# Altium project 28Pins_Project_1[1.PrjPcb (part 2 of 3)
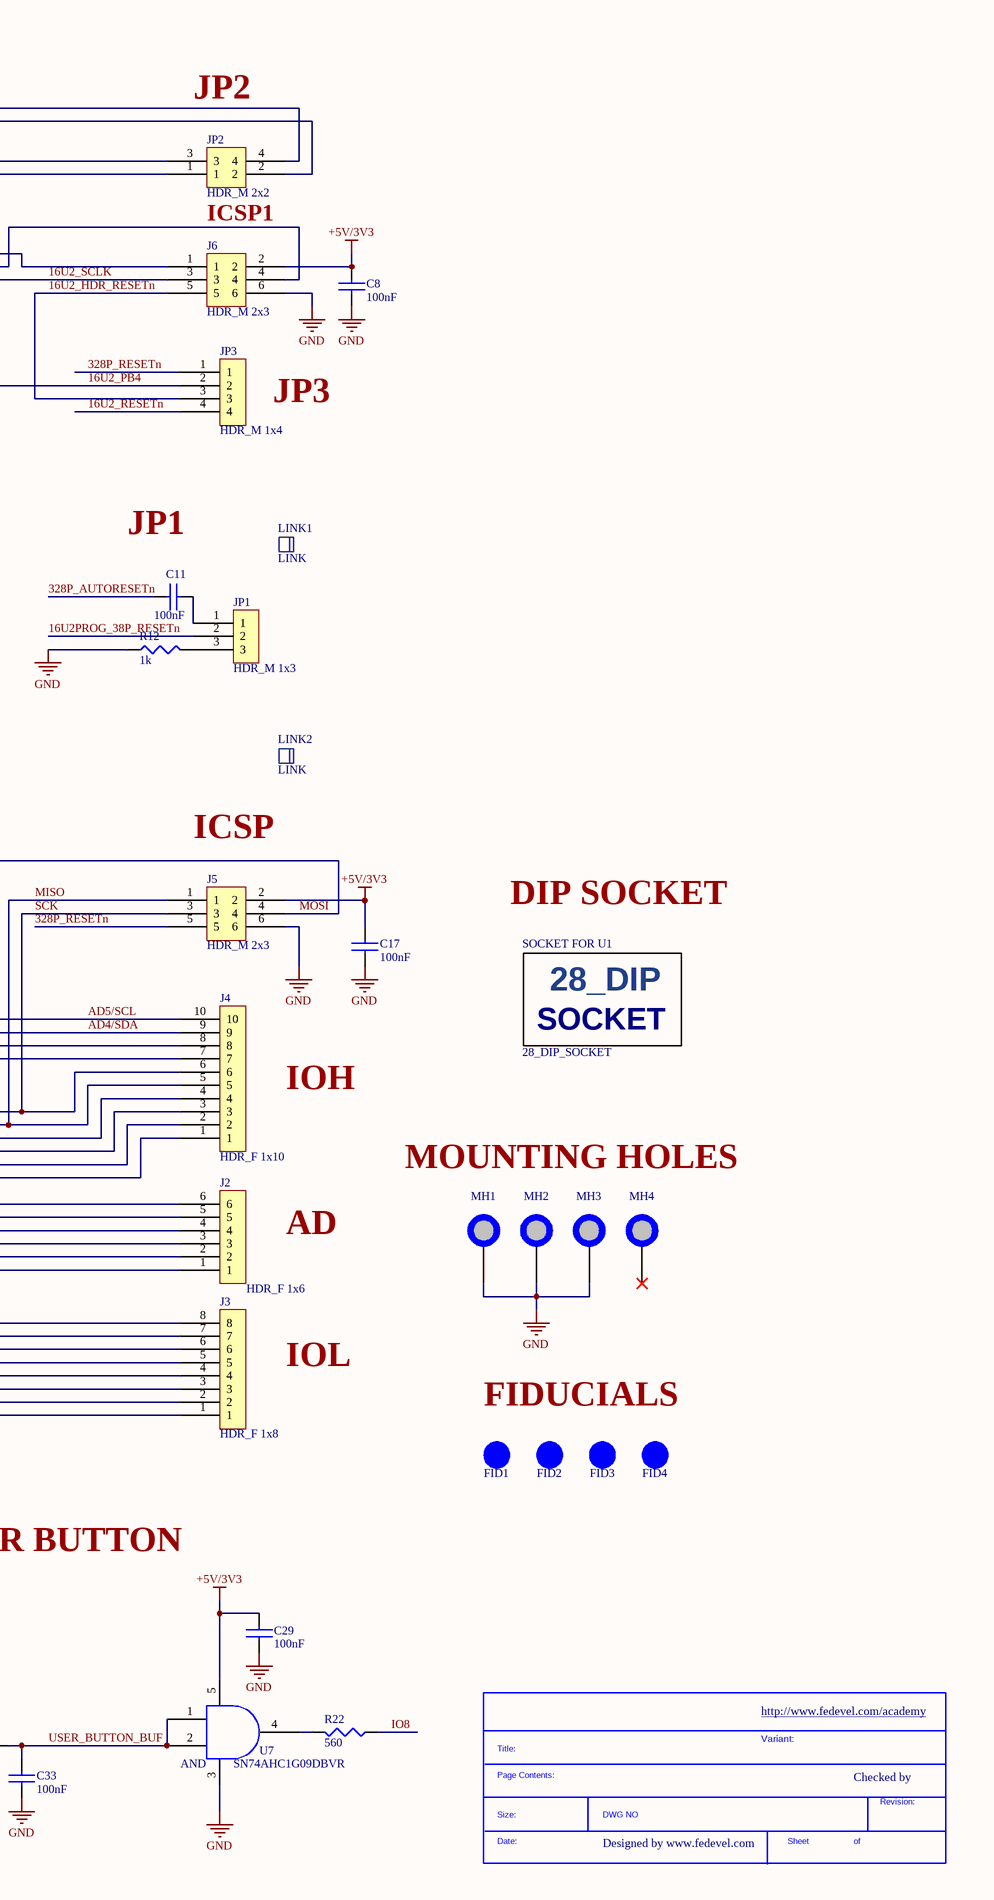
[diagram p3: [03] - 28PINS SCHEMATIC.SchDoc, right]

## Sheet [03] - 28PINS SCHEMATIC.SchDoc: 28 Pins (continued)
### Library data of the parts
C1 C2 = EEE-1AA101WR: Cap Aluminum 100uF 10V 20% (5 X 5.4mm) SMD 50mA 1000 hr 85°C T/R; Manufacturer: Panasonic; Life (Hours): 1000Hour; Supplier 1: Future Electronics; Manufacturer Part Number: EEE-1AA101WR; RoHS: Yes; Category: Aluminum Electrolytic Capacitors; Stock 1: 550; Pricing 1: 1=0,31500, 50=0,15000, 100=0,13300, 250=0,11300, 500=0,10000 (USD); Mount: Surface Mount,PCB; Case/Package: Radial; Contact Plating: Tin; Min Operating Temperature: -40°C; Max Operating Temperature: 85°C; Capacitance: 100uF; Tolerance: 20%; Ripple Current: 50mA; Voltage Rating: 10V; Packaging: Tape and Reel; Package Quantity: 1; Voltage Rating (DC): 10V; Termination: SMD/SMT; Ripple Current (AC): 50mA; Diameter: 5mm; Length: 5.5mm; Height: 5.4mm; Height - Seated (Max): 0.213inch; Radiation Hardening: No; Lead Free: Lead Free; REACH SVHC: Unknown; ComponentLink1URL: https://datasheet.ciiva.com/26945/getdatasheetpartid-169213-26945071.pdf?src-supplier=Verical; ComponentLink1Description: https://datasheet.ciiva.com/26945/getdatasheetpartid-169213-26945071.pdf?src-supplier=Verical; ComponentLink2URL: https://datasheet.ciiva.com/2983/aba0000ce2-2983906.pdf?src-supplier=Avnet; ComponentLink2Description: https://datasheet.ciiva.com/2983/aba0000ce2-2983906.pdf?src-supplier=Avnet; ComponentLink3URL: https://datasheet.ciiva.com/24027/aba0000ce2-40801-24027541.pdf?src-supplier=Mouser; ComponentLink3Description: https://datasheet.ciiva.com/24027/aba0000ce2-40801-24027541.pdf?src-supplier=Mouser; ComponentLink4URL: https://datasheet.ciiva.com/30075/11aba0000ce2-30075303.pdf?src-supplier=Onlinecomponents.com; ComponentLink4Description: https://datasheet.ciiva.com/30075/11aba0000ce2-30075303.pdf?src-supplier=Onlinecomponents.com; ComponentLink5URL: https://datasheet.ciiva.com/16427/aba0000ce2-16427544.pdf?src-supplier=Future+Electronics; ComponentLink5Description: https://datasheet.ciiva.com/16427/aba0000ce2-16427544.pdf?src-supplier=Future+Electronics; ComponentLink6URL: https://datasheet.ciiva.com/14598/70255710-14598233.pdf?src-supplier=Allied+Electronics; ComponentLink6Description: https://datasheet.ciiva.com/14598/70255710-14598233.pdf?src-supplier=Allied+Electronics; ComponentLink7URL: https://datasheet.ciiva.com/14605/70255710-14605689.pdf?src-supplier=Allied+Electronics; ComponentLink7Description: https://datasheet.ciiva.com/14605/70255710-14605689.pdf?src-supplier=Allied+Electronics; ComponentLink8URL: https://datasheet.ciiva.com/11673/aba0000ce2-11673882.pdf?src-supplier=Avnet; ComponentLink8Description: https://datasheet.ciiva.com/11673/aba0000ce2-11673882.pdf?src-supplier=Avnet; Supplier Part Number 1: EEE-1AA101WR-CUTT
C3 C12 C13 C19 C21 C22 C34 = C2012X5R1C106M125AC: CAP CER 10UF 16V X5R 0805; Manufacturer: TDK; Dielectric Material: Ceramic; Tolerance: 20%; Supplier 1: Farnell; Manufacturer Part Number: C2012X5R1C106M125AC; RoHS: Yes; Category: Ceramic Capacitors; Pricing 1: 5=0,27200, 50=0,09480, 250=0,08030, 500=0,07090, 1000=0,06220, 2000=0,04880, 10000=0,04830, 20000=0,04180 (GBP); Mount: Surface Mount; Case/Package: 0805; Number of Pins: 2; Weight: 0.000194oz; Case Code (Metric): 2012; Case Code (Imperial): 0805; Min Operating Temperature: -55°C; Max Operating Temperature: 85°C; Capacitance: 10uF; Voltage Rating: 16V; Packaging: Tape and Reel; Package Quantity: 1; Voltage Rating (DC): 16V; Dielectric: X5R; Termination: SMD/SMT; Composition: Ceramic; Length: 2mm; Height: 1.25mm; Width: 0.049inch; Thickness: 0.057inch; Depth: 1.25mm; REACH SVHC: No SVHC; Lead Free: Lead Free; ComponentLink1URL: https://datasheet.ciiva.com/6289/tdkmlcccaprange-6289238.pdf?src-supplier=Digi-Key; ComponentLink1Description: https://datasheet.ciiva.com/6289/tdkmlcccaprange-6289238.pdf?src-supplier=Digi-Key; ComponentLink2URL: https://datasheet.ciiva.com/22725/1913358-22725558.pdf?src-supplier=Element14; ComponentLink2Description: https://datasheet.ciiva.com/22725/1913358-22725558.pdf?src-supplier=Element14; ComponentLink3URL: https://datasheet.ciiva.com/6252/tdkmlcccaprange-6252105.pdf?src-supplier=Digi-Key; ComponentLink3Description: https://datasheet.ciiva.com/6252/tdkmlcccaprange-6252105.pdf?src-supplier=Digi-Key; ComponentLink4URL: https://datasheet.ciiva.com/6252/tdkmlcccaprange-6252108.pdf?src-supplier=Digi-Key; ComponentLink4Description: https://datasheet.ciiva.com/6252/tdkmlcccaprange-6252108.pdf?src-supplier=Digi-Key; ComponentLink5URL: https://datasheet.ciiva.com/23803/1796654-23803022.pdf?src-supplier=Newark; ComponentLink5Description: https://datasheet.ciiva.com/23803/1796654-23803022.pdf?src-supplier=Newark; Supplier Part Number 1: 2525134
C4-C6 C8 C11 C14-C17 C20 C23 C24 C26 C28-C33 = C2012X7R1H104K085AA: C Series 0805 0.1 uF 50 V ±10 % Tolerance X7R SMT Multilayer Ceramic Capacitor; Manufacturer: TDK; Voltage Rating: 50V; Tolerance: 10%; Supplier 1: Digi-Key; Manufacturer Part Number: C2012X7R1H104K085AA; Category: Ceramic Capacitors; Stock 1: 286254; Pricing 1: 1=0,17000, 10=0,11900, 100=0,05610, 500=0,03936, 1000=0,03258 (USD); Mount: Surface Mount; Case/Package: 0805; Number of Pins: 2; Weight: 0.000194oz; Case Code (Metric): 2012; Case Code (Imperial): 0805; Dielectric Material: Ceramic; Min Operating Temperature: -55°C; Max Operating Temperature: 125°C; Package Quantity: 1; Capacitance: 100nF; Packaging: Tape and Reel; Voltage Rating (DC): 50V; Dielectric: X7R; Termination: SMD/SMT; Composition: Ceramic; Voltage: 50V; Length: 2mm; Height: 0.85mm; Width: 0.049inch; Thickness: 0.037inch; Depth: 1.25mm; Radiation Hardening: No; REACH SVHC: No SVHC; Lead Free: Lead Free; ComponentLink1URL: https://datasheet.ciiva.com/11788/0900766b80c1bb00-11788128.pdf?src-supplier=RSComponents; ComponentLink1Description: https://datasheet.ciiva.com/11788/0900766b80c1bb00-11788128.pdf?src-supplier=RSComponents; ComponentLink2URL: https://datasheet.ciiva.com/24191/e412-c-24191447.pdf?src-supplier=Future+Electronics; ComponentLink2Description: https://datasheet.ciiva.com/24191/e412-c-24191447.pdf?src-supplier=Future+Electronics; ComponentLink3URL: https://datasheet.ciiva.com/6250/tdkmlcccaprange-6250821.pdf?src-supplier=Digi-Key; ComponentLink3Description: https://datasheet.ciiva.com/6250/tdkmlcccaprange-6250821.pdf?src-supplier=Digi-Key; ComponentLink4URL: https://datasheet.ciiva.com/6250/tdkmlcccaprange-6250824.pdf?src-supplier=Digi-Key; ComponentLink4Description: https://datasheet.ciiva.com/6250/tdkmlcccaprange-6250824.pdf?src-supplier=Digi-Key; ComponentLink5URL: https://datasheet.ciiva.com/23803/1796654-23803035.pdf?src-supplier=Newark; ComponentLink5Description: https://datasheet.ciiva.com/23803/1796654-23803035.pdf?src-supplier=Newark; ComponentLink6URL: https://datasheet.ciiva.com/28602/1571323-28602204.pdf?src-supplier=Element14; ComponentLink6Description: https://datasheet.ciiva.com/28602/1571323-28602204.pdf?src-supplier=Element14; ComponentLink7URL: http://datasheet.octopart.com/C2012X7R1H104K085AA-TDK-datasheet-10978788.pdf?src-supplier=Element14; ComponentLink7Description: http://datasheet.octopart.com/C2012X7R1H104K085AA-TDK-datasheet-10978788.pdf?src-supplier=Element14; ComponentLink8URL: http://datasheet.octopart.com/C2012X7R1H104K085AA-TDK-datasheet-41194876.pdf?src-supplier=Element14; ComponentLink8Description: http://datasheet.octopart.com/C2012X7R1H104K085AA-TDK-datasheet-41194876.pdf?src-supplier=Element14; ComponentLink9URL: http://datasheet.octopart.com/C2012X7R1H104K085AA-TDK-datasheet-13444418.pdf?src-supplier=Newark; ComponentLink9Description: http://datasheet.octopart.com/C2012X7R1H104K085AA-TDK-datasheet-13444418.pdf?src-supplier=Newark; ComponentLink10URL: http://datasheet.octopart.com/C2012X7R1H104K085AA-TDK-datasheet-13376850.pdf?src-supplier=Element14; ComponentLink10Description: http://datasheet.octopart.com/C2012X7R1H104K085AA-TDK-datasheet-13376850.pdf?src-supplier=Element14; ComponentLink11URL: http://datasheet.octopart.com/C2012X7R1H104K085AA-TDK-datasheet-41169347.pdf?src-supplier=Element14; ComponentLink11Description: http://datasheet.octopart.com/C2012X7R1H104K085AA-TDK-datasheet-41169347.pdf?src-supplier=Element14; ComponentLink12URL: http://datasheet.octopart.com/C2012X7R1H104K085AA-TDK-datasheet-82475248.pdf?src-supplier=Newark; ComponentLink12Description: http://datasheet.octopart.com/C2012X7R1H104K085AA-TDK-datasheet-82475248.pdf?src-supplier=Newark; ComponentLink13URL: http://datasheet.octopart.com/C2012X7R1H104K085AA-TDK-datasheet-128946.pdf?src-supplier=Future+Electronics; ComponentLink13Description: http://datasheet.octopart.com/C2012X7R1H104K085AA-TDK-datasheet-128946.pdf?src-supplier=Future+Electronics; ComponentLink14URL: http://datasheet.octopart.com/C2012X7R1H104K085AA-TDK-datasheet-8324322.pdf?src-supplier=Future+Electronics; ComponentLink14Description: http://datasheet.octopart.com/C2012X7R1H104K085AA-TDK-datasheet-8324322.pdf?src-supplier=Future+Electronics; ComponentLink15URL: http://datasheet.octopart.com/C2012X7R1H104K085AA-TDK-datasheet-8359770.pdf?src-supplier=Future+Electronics; ComponentLink15Description: http://datasheet.octopart.com/C2012X7R1H104K085AA-TDK-datasheet-8359770.pdf?src-supplier=Future+Electronics; ComponentLink16URL: http://datasheet.octopart.com/C2012X7R1H104K085AA-TDK-datasheet-8852320.pdf?src-supplier=Future+Electronics; ComponentLink16Description: http://datasheet.octopart.com/C2012X7R1H104K085AA-TDK-datasheet-8852320.pdf?src-supplier=Future+Electronics; ComponentLink17URL: http://datasheet.octopart.com/C2012X7R1H104K085AA-TDK-datasheet-12509848.pdf?src-supplier=Future+Electronics; ComponentLink17Description: http://datasheet.octopart.com/C2012X7R1H104K085AA-TDK-datasheet-12509848.pdf?src-supplier=Future+Electronics; ComponentLink18URL: http://datasheet.octopart.com/C2012X7R1H104K085AA-TDK-datasheet-23766614.pdf?src-supplier=Newark; ComponentLink18Description: http://datasheet.octopart.com/C2012X7R1H104K085AA-TDK-datasheet-23766614.pdf?src-supplier=Newark; ComponentLink19URL: http://datasheet.octopart.com/C2012X7R1H104K085AA-TDK-datasheet-11730548.pdf?src-supplier=Electro+Sonic; ComponentLink19Description: http://datasheet.octopart.com/C2012X7R1H104K085AA-TDK-datasheet-11730548.pdf?src-supplier=Electro+Sonic; ComponentLink20URL: http://datasheet.octopart.com/C-Series-Ceramic-Chip-Capacitors-TDK-datasheet-family-84.pdf; ComponentLink20Description: http://datasheet.octopart.com/C-Series-Ceramic-Chip-Capacitors-TDK-datasheet-family-84.pdf; Supplier Part Number 1: 445-7534-1-ND
C7 = C2012X5R1E105K125AA: CAP CER 1UF 25V X5R 0805; Manufacturer: TDK; Dielectric Material: Ceramic; Tolerance: 10%; Supplier 1: Avnet; Manufacturer Part Number: C2012X5R1E105K125AA; RoHS: Yes; Category: Ceramic Capacitors; Stock 1: 2000; Pricing 1: 2000=0,02803, 4000=0,02689, 8000=0,02588, 12000=0,02490, 20000=0,02443 (USD); Mount: Surface Mount; Case/Package: 0805; Number of Pins: 2; Weight: 0.000194oz; Case Code (Metric): 2012; Case Code (Imperial): 0805; Min Operating Temperature: -55°C; Max Operating Temperature: 85°C; Capacitance: 1uF; Voltage Rating: 25V; Packaging: Tape and Reel; Voltage Rating (DC): 25V; Dielectric: X5R; Termination: SMD/SMT; Package Quantity: 2000; Composition: Ceramic; Voltage: 25V; Length: 2mm; Height: 1.25mm; Depth: 1.25mm; Width: 0.049inch; Thickness: 0.057inch; Radiation Hardening: No; Lead Free: Lead Free; REACH SVHC: No SVHC; ComponentLink1URL: https://datasheet.ciiva.com/11787/0900766b80c1bb00-11787608.pdf?src-supplier=RSComponents; ComponentLink1Description: https://datasheet.ciiva.com/11787/0900766b80c1bb00-11787608.pdf?src-supplier=RSComponents; ComponentLink2URL: https://datasheet.ciiva.com/16449/e412-c-16449595.pdf?src-supplier=Future+Electronics; ComponentLink2Description: https://datasheet.ciiva.com/16449/e412-c-16449595.pdf?src-supplier=Future+Electronics; ComponentLink3URL: https://datasheet.ciiva.com/28602/1744655-28602171.pdf?src-supplier=Element14; ComponentLink3Description: https://datasheet.ciiva.com/28602/1744655-28602171.pdf?src-supplier=Element14; ComponentLink4URL: https://datasheet.ciiva.com/15192/getdatasheetpartid-726707-15192140.pdf?src-supplier=Verical; ComponentLink4Description: https://datasheet.ciiva.com/15192/getdatasheetpartid-726707-15192140.pdf?src-supplier=Verical; Supplier Part Number 1: C2012X5R1E105K125AA
C9 C10 C25 C27 = C0805C180J5GACTU: CAP CER 18PF 50V C0G/NP0 0805; Manufacturer: KEMET; Dielectric Material: Ceramic; Tolerance: 5%; Dielectric: C0G; Temperature Coefficient: 30ppm/°C; Supplier 1: Digi-Key; Manufacturer Part Number: C0805C180J5GACTU; RoHS: Yes; Category: Ceramic Capacitors; Stock 1: 88952; Pricing 1: 1=0,14000, 10=0,10000, 100=0,04680, 500=0,03282, 1000=0,02716 (USD); Mount: Surface Mount; Case/Package: 0805; Contact Plating: Tin,Matte; Min Operating Temperature: -55°C; Max Operating Temperature: 125°C; Capacitance: 18pF; Packaging: Tape and Reel; Voltage: 50V; Termination: SMD/SMT; Voltage Rating (DC): 50V; Length: 2mm; Height: 0.78mm; Depth: 1.25mm; Radiation Hardening: No; Lead Free: Lead Free; ComponentLink1URL: https://datasheet.ciiva.com/22746/1769375-22746770.pdf?src-supplier=Element14; ComponentLink1Description: https://datasheet.ciiva.com/22746/1769375-22746770.pdf?src-supplier=Element14; ComponentLink2URL: https://datasheet.ciiva.com/26923/getdatasheetpartid-759702-26923980.pdf?src-supplier=Verical; ComponentLink2Description: https://datasheet.ciiva.com/26923/getdatasheetpartid-759702-26923980.pdf?src-supplier=Verical; ComponentLink3URL: https://datasheet.ciiva.com/26847/getdatasheetpartid-385668-26847862.pdf?src-supplier=Verical; ComponentLink3Description: https://datasheet.ciiva.com/26847/getdatasheetpartid-385668-26847862.pdf?src-supplier=Verical; Supplier Part Number 1: 399-1112-1-ND
D1 = LGL29K-G2J1-24-Z: LED Uni-Color Green 572nm 2-Pin Chip 0603(1608Metric) T/R; Manufacturer: Osram Opto; Lens Color: White; Forward Current: 20mA; Forward Voltage: 2.2V; Luminous Intensity: 5.6mcd; Viewing Angle: 160°; Lens Style: Flat,Diffused,Colorless,Rectangular; Test Current: 2mA; Dominant Wavelength: 570nm; Luminous Flux: 0.012lm; Number of LEDs: 1; Lens Transparency: Diffused; Reverse Voltage: 12V; Lens Size: 0.8mm; Supplier 1: Mouser; Manufacturer Part Number: LGL29K-G2J1-24-Z; RoHS: Yes; Category: Uncategorized; Stock 1: 225780; Pricing 1: 1=0,50000, 10=0,36000, 100=0,17000, 1000=0,13300, 5000=0,10500, 10000=0,09800 (USD); Mount: Surface Mount; Case/Package: 0603; Number of Pins: 2; Color: Green; Case Code (Metric): 1608; Case Code (Imperial): 0603; Min Operating Temperature: -40°C; Max Operating Temperature: 100°C; Illumination Color: Green; Packaging: Tape and Reel; Package Quantity: 5000; Number of Elements: 1; Length: 1.3mm; Height: 0.65mm; Width: 0.8mm; Depth: 0.8mm; Radiation Hardening: No; ComponentLink1URL: https://datasheet.ciiva.com/4689/g-l29k-39844-4689584.pdf?src-supplier=Mouser; ComponentLink1Description: https://datasheet.ciiva.com/4689/g-l29k-39844-4689584.pdf?src-supplier=Mouser; ComponentLink2URL: https://datasheet.ciiva.com/15198/getdatasheetpartid-571127-15198411.pdf?src-supplier=Verical; ComponentLink2Description: https://datasheet.ciiva.com/15198/getdatasheetpartid-571127-15198411.pdf?src-supplier=Verical; ComponentLink3URL: https://datasheet.ciiva.com/2112/00077107-0-2112886.pdf?src-supplier=Digi-Key; ComponentLink3Description: https://datasheet.ciiva.com/2112/00077107-0-2112886.pdf?src-supplier=Digi-Key; ComponentLink4URL: https://datasheet.ciiva.com/2112/00077107-0-2112887.pdf?src-supplier=Digi-Key; ComponentLink4Description: https://datasheet.ciiva.com/2112/00077107-0-2112887.pdf?src-supplier=Digi-Key; ComponentLink5URL: https://datasheet.ciiva.com/2112/00077107-0-2112888.pdf?src-supplier=Digi-Key; ComponentLink5Description: https://datasheet.ciiva.com/2112/00077107-0-2112888.pdf?src-supplier=Digi-Key; Supplier Part Number 1: 720-LGL29KG2J124Z
D2-D4 = LOL29K-H2K1-24-Z: LED ORANGE DIFFUSED 0603 SMD; Manufacturer: Osram Opto; Forward Current: 20mA; Forward Voltage: 1.8V; Luminous Intensity: 6.3mcd; Viewing Angle: 160°; Lens Style: Diffused,Colorless,Rectangular; Test Current: 2mA; Dominant Wavelength: 606nm; Luminous Flux: 0.025lm; Number of LEDs: 1; Supplier 1: Newark; Manufacturer Part Number: LOL29K-H2K1-24-Z; RoHS: Yes; Category: Uncategorized; Mount: Surface Mount; Case/Package: 0603; Number of Pins: 2; Color: Orange; Case Code (Metric): 1608; Case Code (Imperial): 0603; Min Operating Temperature: -40°C; Max Operating Temperature: 100°C; Illumination Color: Orange; Packaging: Tape and Reel; Package Quantity: 5000; Length: 1.7mm; Height: 0.65mm; Width: 0.8mm; ComponentLink1URL: https://datasheet.ciiva.com/2112/00077105-0-2112904.pdf?src-supplier=Digi-Key; ComponentLink1Description: https://datasheet.ciiva.com/2112/00077105-0-2112904.pdf?src-supplier=Digi-Key; ComponentLink2URL: https://datasheet.ciiva.com/2112/00077105-0-2112905.pdf?src-supplier=Digi-Key; ComponentLink2Description: https://datasheet.ciiva.com/2112/00077105-0-2112905.pdf?src-supplier=Digi-Key; ComponentLink3URL: https://datasheet.ciiva.com/2112/00077105-0-2112906.pdf?src-supplier=Digi-Key; ComponentLink3Description: https://datasheet.ciiva.com/2112/00077105-0-2112906.pdf?src-supplier=Digi-Key; ComponentLink4URL: https://datasheet.ciiva.com/15198/getdatasheetpartid-693885-15198412.pdf?src-supplier=Verical; ComponentLink4Description: https://datasheet.ciiva.com/15198/getdatasheetpartid-693885-15198412.pdf?src-supplier=Verical; Supplier Part Number 1: 32AC1122
D5 D6 = BAT54HT1G: DIODE SCHOTTKY 30V 200MA SOD323; Manufacturer: ON Semiconductor / Fairchild; Forward Voltage: 800mV; Recovery Time: 5ns; Peak Non-Repetitive Surge Current: 600mA; Element Configuration: Single; Peak Reverse Current: 2uA; Power Dissipation: 200mW; Polarity: Standard; Capacitance: 10pF; Supplier 1: Future Electronics; Manufacturer Part Number: BAT54HT1G; RoHS: Yes; Category: Rectifier Diodes; Stock 1: 6016316; Pricing 1: 1=0,18600, 250=0,06030, 500=0,05230, 750=0,04810, 1500=0,04180 (USD); Mount: Surface Mount; Number of Pins: 2; Contact Plating: Tin,Matte; Min Operating Temperature: -55°C; Max Operating Temperature: 150°C; Packaging: Tape and Reel; Package Quantity: 3000; Forward Current: 200mA; Average Rectified Current: 200mA; Reverse Recovery Time: 5ns; Max Repetitive Reverse Voltage (Vrrm): 30V; Max Forward Surge Current (Ifsm): 600mA; Max Reverse Voltage (DC): 30V; Max Surge Current: 600mA; Voltage Rating (DC): 30V; Current Rating: 200mA; Output Current: 200mA; Reverse Voltage: 30V; Max Reverse Leakage Current: 2uA; Length: 1.8mm; Height: 1mm; Width: 1.35mm; Radiation Hardening: No; Lead Free: Lead Free; REACH SVHC: No SVHC; ComponentLink1URL: https://datasheet.ciiva.com/4714/bat54ht1-d-72881-4714706.pdf?src-supplier=Mouser; ComponentLink1Description: https://datasheet.ciiva.com/4714/bat54ht1-d-72881-4714706.pdf?src-supplier=Mouser; ComponentLink2URL: https://datasheet.ciiva.com/30479/0900766b811a63a9-30479442.pdf?src-supplier=RSComponents; ComponentLink2Description: https://datasheet.ciiva.com/30479/0900766b811a63a9-30479442.pdf?src-supplier=RSComponents; ComponentLink3URL: https://datasheet.ciiva.com/34301/806549-34301562.pdf?src-supplier=Jameco; ComponentLink3Description: https://datasheet.ciiva.com/34301/806549-34301562.pdf?src-supplier=Jameco; ComponentLink4URL: https://datasheet.ciiva.com/1240/1747983-1240762.pdf?src-supplier=Newark; ComponentLink4Description: https://datasheet.ciiva.com/1240/1747983-1240762.pdf?src-supplier=Newark; ComponentLink5URL: https://datasheet.ciiva.com/4452/bat54ht1g-104602-4452889.pdf?src-supplier=Mouser; ComponentLink5Description: https://datasheet.ciiva.com/4452/bat54ht1g-104602-4452889.pdf?src-supplier=Mouser; ComponentLink6URL: https://datasheet.ciiva.com/910/bat54ht1g-910497.pdf?src-supplier=Digi-Key; ComponentLink6Description: https://datasheet.ciiva.com/910/bat54ht1g-910497.pdf?src-supplier=Digi-Key; ComponentLink7URL: https://datasheet.ciiva.com/1180/bat54ht1-d-1180252.pdf?src-supplier=Element14; ComponentLink7Description: https://datasheet.ciiva.com/1180/bat54ht1-d-1180252.pdf?src-supplier=Element14; ComponentLink8URL: https://datasheet.ciiva.com/1180/bat54ht1-d-1180251.pdf?src-supplier=Element14; ComponentLink8Description: https://datasheet.ciiva.com/1180/bat54ht1-d-1180251.pdf?src-supplier=Element14; ComponentLink9URL: https://datasheet.ciiva.com/46429/1727620-46429206.pdf?src-supplier=Element14; ComponentLink9Description: https://datasheet.ciiva.com/46429/1727620-46429206.pdf?src-supplier=Element14; ComponentLink10URL: https://datasheet.ciiva.com/8294/bat54ht1-d-8294645.pdf?src-supplier=Avnet; ComponentLink10Description: https://datasheet.ciiva.com/8294/bat54ht1-d-8294645.pdf?src-supplier=Avnet; ComponentLink11URL: https://datasheet.ciiva.com/915/bat54ht1-d-915445.pdf?src-supplier=Digi-Key; ComponentLink11Description: https://datasheet.ciiva.com/915/bat54ht1-d-915445.pdf?src-supplier=Digi-Key; ComponentLink12URL: https://datasheet.ciiva.com/915/bat54ht1-d-915444.pdf?src-supplier=Digi-Key; ComponentLink12Description: https://datasheet.ciiva.com/915/bat54ht1-d-915444.pdf?src-supplier=Digi-Key; ComponentLink13URL: https://datasheet.ciiva.com/915/bat54ht1-d-915443.pdf?src-supplier=Digi-Key; ComponentLink13Description: https://datasheet.ciiva.com/915/bat54ht1-d-915443.pdf?src-supplier=Digi-Key; ComponentLink14URL: https://datasheet.ciiva.com/910/bat54ht1g-910499.pdf?src-supplier=Digi-Key; ComponentLink14Description: https://datasheet.ciiva.com/910/bat54ht1g-910499.pdf?src-supplier=Digi-Key; ComponentLink15URL: https://datasheet.ciiva.com/910/bat54ht1g-910498.pdf?src-supplier=Digi-Key; ComponentLink15Description: https://datasheet.ciiva.com/910/bat54ht1g-910498.pdf?src-supplier=Digi-Key; ComponentLink16URL: https://datasheet.ciiva.com/8303/bat54ht1g-8303645.pdf?src-supplier=Avnet; ComponentLink16Description: https://datasheet.ciiva.com/8303/bat54ht1g-8303645.pdf?src-supplier=Avnet; ComponentLink17URL: https://datasheet.ciiva.com/17020/bat54ht1g-17020445.pdf?src-supplier=Future+Electronics; ComponentLink17Description: https://datasheet.ciiva.com/17020/bat54ht1g-17020445.pdf?src-supplier=Future+Electronics; ComponentLink18URL: https://datasheet.ciiva.com/48686/001262925-da-01-en-diode-schottky-30v-bat54ht1g-sod-323-fsc-48686266.pdf?src-supplier=Conrad; ComponentLink18Description: https://datasheet.ciiva.com/48686/001262925-da-01-en-diode-schottky-30v-bat54ht1g-sod-323-fsc-48686266.pdf?src-supplier=Conrad; Supplier Part Number 1: BAT54HT1G-CUTT
FB1-FB3 = MPZ2012S601AT000: Ferrite Beads Multi-Layer Power 600Ohm 25% 100MHz 2A 100mOhm DCR 0805 T/R; Manufacturer: TDK; Impedance: 600R; DC Resistance (DCR): 100mR; Supplier 1: Digi-Key; Manufacturer Part Number: MPZ2012S601AT000; RoHS: Yes; Category: Inductors; Stock 1: 128173; Pricing 1: 1=0,11000, 10=0,09100, 25=0,07040, 50=0,05840, 100=0,05030, 250=0,04028, 500=0,03624, 1000=0,03020 (USD); Mount: Surface Mount; Case/Package: 0805; Case Code (Metric): 2012; Case Code (Imperial): 0805; Packaging: Tape and Reel; Package Quantity: 1; Current Rating: 2A; Max DC Current: 2A; Length: 0.079inch; Height: 0.041inch; Width: 0.049inch; REACH SVHC: No SVHC; Lead Free: Lead Free; ComponentLink1URL: https://datasheet.ciiva.com/46634/beads-commercial-power-mpz-en-46634377.pdf?src-supplier=Digi-Key; ComponentLink1Description: https://datasheet.ciiva.com/46634/beads-commercial-power-mpz-en-46634377.pdf?src-supplier=Digi-Key; ComponentLink2URL: https://datasheet.ciiva.com/46634/beads-commercial-power-mpz-en-46634606.pdf?src-supplier=Digi-Key; ComponentLink2Description: https://datasheet.ciiva.com/46634/beads-commercial-power-mpz-en-46634606.pdf?src-supplier=Digi-Key; ComponentLink3URL: https://datasheet.ciiva.com/46634/beads-commercial-power-mpz-en-46634335.pdf?src-supplier=Digi-Key; ComponentLink3Description: https://datasheet.ciiva.com/46634/beads-commercial-power-mpz-en-46634335.pdf?src-supplier=Digi-Key; Supplier Part Number 1: 445-2206-1-ND
FID1-FID4 = FID_1mm: Fiducial 40mil Diameter, 120mil mask
J1 J3 = M20-7820842: 2.54mm (0.1") Pitch SIL Vertical PC Tail Socket Assembly, selective gold + tin, 8 contacts; Manufacturer: Harwin; Max Current Rating: 3A; Contact Resistance: 20mR; Number of Positions: 8; Connector Type: Receptacle; Gender: Female; Supplier 1: Digi-Key; Manufacturer Part Number: M20-7820842; Category: Headers and Wire Housings; Stock 1: 3264; Pricing 1: 1=1,10000, 10=0,97200, 100=0,83820, 500=0,68580, 1000=0,60960, 5000=0,53340, 10000=0,50673 (USD); Mount: Through Hole; Case/Package: SIL; Weight: 0.025397oz; Contact Plating: Tin; Color: Black; Contact Material: Bronze; Housing Color: Black; Housing Material: Polyamide; Min Operating Temperature: -40°C; Max Operating Temperature: 105°C; Number of Rows: 1; Contact Gender: Female; Package Quantity: 29; Packaging: Rail/Tube; Termination: Solder; Number of Contacts: 8; Orientation: Straight; Length: 20.72mm; Pitch: 2.54mm; Depth: 2.5mm; Radiation Hardening: No; ComponentLink1URL: https://datasheet.ciiva.com/16732/m20-782-16732663.pdf?src-supplier=Avnet+Europe; ComponentLink1Description: https://datasheet.ciiva.com/16732/m20-782-16732663.pdf?src-supplier=Avnet+Europe; ComponentLink2URL: https://datasheet.ciiva.com/9480/m20-782-9480074.pdf?src-supplier=Avnet; ComponentLink2Description: https://datasheet.ciiva.com/9480/m20-782-9480074.pdf?src-supplier=Avnet; ComponentLink3URL: http://datasheet.octopart.com/M20-7820842-Harwin-datasheet-99119574.pdf; ComponentLink3Description: http://datasheet.octopart.com/M20-7820842-Harwin-datasheet-99119574.pdf; Supplier Part Number 1: 952-1823-ND
J2 = M20-7820646: 2.54mm (0.1") Pitch SIL Vertical PC Tail Socket Assembly, tin, 6 contacts; Manufacturer: Harwin; Max Current Rating: 3A; Contact Resistance: 20mR; Connector Type: Receptacle; Number of Positions: 6; Gender: Female; Supplier 1: Digi-Key; Manufacturer Part Number: M20-7820646; Category: Headers and Wire Housings; Stock 1: 1623; Pricing 1: 1=0,96000, 10=0,84200, 100=0,72600, 500=0,59400, 1000=0,52800, 5000=0,46200, 10000=0,43890 (USD); Mount: Through Hole; Case/Package: SIL; Color: Black; Contact Plating: Tin; Contact Material: Bronze; Housing Color: Black; Housing Material: Nylon; Min Operating Temperature: -40°C; Max Operating Temperature: 105°C; Packaging: Rail/Tube; Number of Rows: 1; Contact Gender: Female; Package Quantity: 38; Termination: Solder; Number of Contacts: 6; Orientation: Straight; Length: 15.64mm; Pitch: 2.54mm; Depth: 2.5mm; Radiation Hardening: No; ComponentLink1URL: http://components.arrow.com/part/dataview/0323_00725884?src-supplier=Arrow+Europe; ComponentLink1Description: http://components.arrow.com/part/dataview/0323_00725884?src-supplier=Arrow+Europe; ComponentLink2URL: http://www.harwin.com/include/downloads/pdfs/2010PAGE120.PDF?src-supplier=Avnet; ComponentLink2Description: http://www.harwin.com/include/downloads/pdfs/2010PAGE120.PDF?src-supplier=Avnet; ComponentLink3URL: https://cdn.harwin.com/pdfs/M20-782.pdf?src-supplier=Digi-Key; ComponentLink3Description: https://cdn.harwin.com/pdfs/M20-782.pdf?src-supplier=Digi-Key; ComponentLink4URL: https://cdn.harwin.com/pdfs/Harwin_PC_Connectors_M20.pdf?src-supplier=Avnet+Europe; ComponentLink4Description: https://cdn.harwin.com/pdfs/Harwin_PC_Connectors_M20.pdf?src-supplier=Avnet+Europe; ComponentLink5URL: https://cdn.harwin.com/pdfs/Harwin_PC_Connectors_M20.pdf?src-supplier=Mouser; ComponentLink5Description: https://cdn.harwin.com/pdfs/Harwin_PC_Connectors_M20.pdf?src-supplier=Mouser; ComponentLink6URL: https://cdn.harwin.com/pdfs/Harwin_PC_Connectors_M20.pdf?src-supplier=RSComponents; ComponentLink6Description: https://cdn.harwin.com/pdfs/Harwin_PC_Connectors_M20.pdf?src-supplier=RSComponents; ComponentLink7URL: https://cdn.harwin.com/pdfs/Harwin_PC_Connectors_M20.pdf?src-supplier=TTI; ComponentLink7Description: https://cdn.harwin.com/pdfs/Harwin_PC_Connectors_M20.pdf?src-supplier=TTI; ComponentLink8URL: http://datasheet.octopart.com/M20-7820646-Harwin-datasheet-99119574.pdf; ComponentLink8Description: http://datasheet.octopart.com/M20-7820646-Harwin-datasheet-99119574.pdf; ComponentLink9URL: http://datasheet.octopart.com/M20-7820646-Harwin-datasheet-137074310.pdf?src-supplier=X-ON; ComponentLink9Description: http://datasheet.octopart.com/M20-7820646-Harwin-datasheet-137074310.pdf?src-supplier=X-ON; Supplier Part Number 1: 952-1809-ND
J4 = M20-7821046: 2.54mm (0.1") Pitch SIL Vertical PC Tail Socket Assembly, tin, 10 contacts; Manufacturer: Harwin; Max Current Rating: 3A; Contact Resistance: 20mR; Mating Cycles: 50; Connector Type: Receptacle; Number of Positions: 10; Insulation Resistance: 1MR; Hole Diameter: 0.8mm; Supplier 1: Digi-Key; Manufacturer Part Number: M20-7821046; Category: Headers and Wire Housings; Stock 1: 134; Pricing 1: 1=1,28000, 10=1,12200, 100=0,96800, 500=0,79200, 1000=0,70400, 5000=0,61600, 10000=0,58520 (USD); Mount: Through Hole; Case/Package: SIL; Color: Black; Contact Plating: Tin; Contact Material: Bronze; Housing Color: Black; Housing Material: Polyamide; Min Operating Temperature: -40°C; Max Operating Temperature: 105°C; Packaging: Rail/Tube; Number of Rows: 1; Contact Gender: Female; Package Quantity: 23; Current Rating: 3A; Termination: Solder; Number of Contacts: 10; Gender: Receptacle; Orientation: Straight; Length: 25.8mm; Lead Pitch: 2.54mm; Pitch: 2.54mm; Depth: 2.5mm; Radiation Hardening: No; REACH SVHC: No SVHC; ComponentLink1URL: https://datasheet.ciiva.com/26899/getdatasheetpartid-559226-26899379.pdf?src-supplier=Verical; ComponentLink1Description: https://datasheet.ciiva.com/26899/getdatasheetpartid-559226-26899379.pdf?src-supplier=Verical; ComponentLink2URL: https://datasheet.ciiva.com/11753/0900766b80dc1d2b-11753869.pdf?src-supplier=RSComponents; ComponentLink2Description: https://datasheet.ciiva.com/11753/0900766b80dc1d2b-11753869.pdf?src-supplier=RSComponents; ComponentLink3URL: https://datasheet.ciiva.com/6785/m20-782-6785605.pdf?src-supplier=Digi-Key; ComponentLink3Description: https://datasheet.ciiva.com/6785/m20-782-6785605.pdf?src-supplier=Digi-Key; ComponentLink4URL: https://datasheet.ciiva.com/10151/m20-782-10151366.pdf?src-supplier=Avnet; ComponentLink4Description: https://datasheet.ciiva.com/10151/m20-782-10151366.pdf?src-supplier=Avnet; ComponentLink5URL: https://datasheet.ciiva.com/16732/m20-782-16732152.pdf?src-supplier=Avnet+Europe; ComponentLink5Description: https://datasheet.ciiva.com/16732/m20-782-16732152.pdf?src-supplier=Avnet+Europe; ComponentLink6URL: http://datasheet.octopart.com/M20-7821046-Harwin-datasheet-96624206.pdf?src-supplier=Element14; ComponentLink6Description: http://datasheet.octopart.com/M20-7821046-Harwin-datasheet-96624206.pdf?src-supplier=Element14; ComponentLink7URL: http://datasheet.octopart.com/M20-7821046-Harwin-datasheet-6396485.pdf?src-supplier=Newark; ComponentLink7Description: http://datasheet.octopart.com/M20-7821046-Harwin-datasheet-6396485.pdf?src-supplier=Newark; ComponentLink8URL: http://datasheet.octopart.com/M20-7821046-Harwin-datasheet-526273.pdf?src-supplier=Farnell; ComponentLink8Description: http://datasheet.octopart.com/M20-7821046-Harwin-datasheet-526273.pdf?src-supplier=Farnell; ComponentLink9URL: http://datasheet.octopart.com/M20-7821046-Harwin-datasheet-14706651.pdf?src-supplier=Farnell; ComponentLink9Description: http://datasheet.octopart.com/M20-7821046-Harwin-datasheet-14706651.pdf?src-supplier=Farnell; ComponentLink10URL: http://datasheet.octopart.com/M20-7821046-Harwin-datasheet-32864534.pdf?src-supplier=Newark; ComponentLink10Description: http://datasheet.octopart.com/M20-7821046-Harwin-datasheet-32864534.pdf?src-supplier=Newark; ComponentLink11URL: http://datasheet.octopart.com/M20-7821046-Harwin-datasheet-15888280.pdf?src-supplier=Newark; ComponentLink11Description: http://datasheet.octopart.com/M20-7821046-Harwin-datasheet-15888280.pdf?src-supplier=Newark; ComponentLink12URL: http://datasheet.octopart.com/M20-7821046-Harwin-datasheet-99119574.pdf; ComponentLink12Description: http://datasheet.octopart.com/M20-7821046-Harwin-datasheet-99119574.pdf; Supplier Part Number 1: 952-1847-ND
J5 J6 = 67997-106HLF: CONN HEADER VERT 6POS 2.54MM; Manufacturer: Amphenol FCI; Number of Contacts: 6; Current Rating: 3A; Voltage Rating: 1.5kV; Insulation Resistance: 5GR; Gender: Male; Connector Type: Male Pin; Row Spacing: 0.1inch; Contact Post Length: 3.05mm; Supplier 1: Digi-Key; Manufacturer Part Number: 67997-106HLF; RoHS: Yes; Category: Headers and Wire Housings; Stock 1: 1129; Pricing 1: 1=1,78000, 10=1,61400, 100=1,38370, 500=1,15308, 1000=0,98835, 5000=0,87634, 10000=0,85657 (USD); Mount: Through Hole; Contact Plating: Gold,GXT; Contact Material: Bronze; Color: Black; Housing Color: Black; Housing Material: Thermoplastic; Min Operating Temperature: -65°C; Max Operating Temperature: 125°C; Number of Rows: 2; Termination: Through Hole; Packaging: Bulk; Package Quantity: 100; Contact Gender: Male; Number of Positions: 6; Max Voltage Rating (AC): 1.5kV; Orientation: Straight; Length: 7.62mm; Pitch: 2.54mm; Contact Mating Length: 0.23inch; Depth: 4.83mm; Radiation Hardening: No; REACH SVHC: No SVHC; Lead Free: Lead Free; Flammability Rating: UL94 V-0; ComponentLink1URL: https://datasheet.ciiva.com/5153/67996-222463-5153820.pdf?src-supplier=Mouser; ComponentLink1Description: https://datasheet.ciiva.com/5153/67996-222463-5153820.pdf?src-supplier=Mouser; ComponentLink2URL: https://datasheet.ciiva.com/10149/67996-10149221.pdf?src-supplier=Avnet; ComponentLink2Description: https://datasheet.ciiva.com/10149/67996-10149221.pdf?src-supplier=Avnet; ComponentLink3URL: https://datasheet.ciiva.com/46393/1876884-46393067.pdf?src-supplier=Element14; ComponentLink3Description: https://datasheet.ciiva.com/46393/1876884-46393067.pdf?src-supplier=Element14; ComponentLink4URL: https://datasheet.ciiva.com/722/67996-722044.pdf?src-supplier=Digi-Key; ComponentLink4Description: https://datasheet.ciiva.com/722/67996-722044.pdf?src-supplier=Digi-Key; ComponentLink5URL: https://datasheet.ciiva.com/16726/67996-16726286.pdf?src-supplier=Avnet+Europe; ComponentLink5Description: https://datasheet.ciiva.com/16726/67996-16726286.pdf?src-supplier=Avnet+Europe; Supplier Part Number 1: 609-3393-ND
J7 = 10118193-0001LF: CONN RCPT USB2.0 MICRO B SMD R/A; Manufacturer: Amphenol FCI; Gender: Female; Connector Type: USB,Receptacle; Number of Contacts: 5; Insulation Resistance: 1GR; Number of Ports: 1; Current Rating: 1.8A; Max Voltage Rating (AC): 100V; Pitch: 0.65mm; Supplier 1: Digi-Key; Manufacturer Part Number: 10118193-0001LF; RoHS: Yes; Category: USB Connectors; Stock 1: 16601; Pricing 1: 1=0,43000, 10=0,40500, 25=0,36480, 50=0,32420, 100=0,31070, 250=0,28368, 500=0,27016 (USD); Mount: Surface Mount,Horizontal; Contact Material: Copper Alloy; Contact Plating: Gold; Color: Black; Number of Terminals: 5; Housing Material: Polymer; Min Operating Temperature: -55°C; Max Operating Temperature: 85°C; Termination: Solder; Orientation: Right Angle; Package Quantity: 1200; Packaging: Tape and Reel; Voltage Rating: 100V; Features: Shielded; Length: 7.86mm; Depth: 5.67mm; Radiation Hardening: No; Flammability Rating: UL94 V-0; ComponentLink1URL: https://datasheet.ciiva.com/851/10118193-851106.pdf?src-supplier=Digi-Key; ComponentLink1Description: https://datasheet.ciiva.com/851/10118193-851106.pdf?src-supplier=Digi-Key; ComponentLink2URL: https://datasheet.ciiva.com/14802/10118193-0001lf-webpage-14802386.pdf?src-supplier=Arrow; ComponentLink2Description: https://datasheet.ciiva.com/14802/10118193-0001lf-webpage-14802386.pdf?src-supplier=Arrow; ComponentLink3URL: https://datasheet.ciiva.com/26853/getdatasheetpartid-418618-26853893.pdf?src-supplier=Verical; ComponentLink3Description: https://datasheet.ciiva.com/26853/getdatasheetpartid-418618-26853893.pdf?src-supplier=Verical; ComponentLink4URL: https://datasheet.ciiva.com/4598/10118193ac-197151-4598799.pdf?src-supplier=Mouser; ComponentLink4Description: https://datasheet.ciiva.com/4598/10118193ac-197151-4598799.pdf?src-supplier=Mouser; ComponentLink5URL: https://datasheet.ciiva.com/851/10118193-851107.pdf?src-supplier=Digi-Key; ComponentLink5Description: https://datasheet.ciiva.com/851/10118193-851107.pdf?src-supplier=Digi-Key; ComponentLink6URL: https://datasheet.ciiva.com/851/10118193-851108.pdf?src-supplier=Digi-Key; ComponentLink6Description: https://datasheet.ciiva.com/851/10118193-851108.pdf?src-supplier=Digi-Key; ComponentLink7URL: https://datasheet.ciiva.com/14618/70236827-14618887.pdf?src-supplier=Allied+Electronics; ComponentLink7Description: https://datasheet.ciiva.com/14618/70236827-14618887.pdf?src-supplier=Allied+Electronics; Supplier Part Number 1: 609-4616-6-ND
J8 J9 = PAD_WITH_HOLE_4mmx1.5mm
JP1 JP4 = 68000-103HLF: CONN HEADER VERT 3POS 2.54MM; Manufacturer: Amphenol FCI; Number of Contacts: 3; Current Rating: 3A; Voltage Rating: 1.5kV; Insulation Resistance: 5GR; Gender: Male; Connector Type: Male Pin; Contact Post Length: 2.41mm; Supplier 1: Avnet; Manufacturer Part Number: 68000-103HLF; RoHS: Yes; Category: Headers and Wire Housings; Stock 1: 39302; Pricing 1: 4000=0,11881, 8000=0,11551, 16000=0,11238, 24000=0,10943, 40000=0,10662 (USD); Mount: Through Hole; Contact Plating: Gold,GXT; Contact Material: Bronze; Color: Black; Housing Color: Black; Housing Material: Thermoplastic; Min Operating Temperature: -65°C; Max Operating Temperature: 125°C; Number of Rows: 1; Termination: Solder; Contact Gender: Male; Package Quantity: 100; Packaging: Bulk; Number of Positions: 3; Max Voltage Rating (AC): 1.5kV; Orientation: Straight; Length: 7.62mm; Pitch: 2.54mm; Contact Mating Length: 0.23inch; Depth: 2.41mm; Radiation Hardening: No; REACH SVHC: No SVHC; Flammability Rating: UL94 V-0; ComponentLink1URL: https://datasheet.ciiva.com/5157/68000-274283-5157301.pdf?src-supplier=Mouser; ComponentLink1Description: https://datasheet.ciiva.com/5157/68000-274283-5157301.pdf?src-supplier=Mouser; ComponentLink2URL: https://datasheet.ciiva.com/46392/1914865-46392021.pdf?src-supplier=Element14; ComponentLink2Description: https://datasheet.ciiva.com/46392/1914865-46392021.pdf?src-supplier=Element14; ComponentLink3URL: https://datasheet.ciiva.com/10149/68000-10149754.pdf?src-supplier=Avnet; ComponentLink3Description: https://datasheet.ciiva.com/10149/68000-10149754.pdf?src-supplier=Avnet
JP2 = 68602-204HLF: CONN HEADER VERT 4POS 2.54MM; Manufacturer: Amphenol FCI; Voltage Rating: 1.5kV; Number of Positions: 4; Gender: Male; Connector Type: Male Pin; Current Rating: 3A; Insulation Resistance: 5GR; Row Spacing: 0.1inch; Contact Post Length: 3.81mm; Supplier 1: Digi-Key; Manufacturer Part Number: 68602-204HLF; RoHS: Yes; Category: Headers and Wire Housings; Stock 1: 239; Pricing 1: 1=0,34000, 10=0,31900, 100=0,22320, 500=0,19132, 1000=0,15943, 5000=0,13665, 10000=0,12754 (USD); Mount: Through Hole; Contact Plating: Gold,GXT; Color: Black; Contact Material: Bronze; Housing Material: Thermoplastic; Min Operating Temperature: -65°C; Max Operating Temperature: 125°C; Packaging: Bulk; Number of Rows: 2; Package Quantity: 100; Termination: Solder; Number of Contacts: 4; Contact Gender: Male; Pitch: 2.54mm; Contact Mating Length: 0.23inch; Radiation Hardening: No; Flammability Rating: UL94 V-0; ComponentLink1URL: https://datasheet.ciiva.com/728/67996-728884.pdf?src-supplier=Digi-Key; ComponentLink1Description: https://datasheet.ciiva.com/728/67996-728884.pdf?src-supplier=Digi-Key; Supplier Part Number 1: 609-3369-ND
JP3 = 68001-204HLF: CONN HEADER VERT 4POS 2.54MM; Manufacturer: Amphenol FCI; Current Rating: 3A; Voltage Rating: 1.5kV; Number of Positions: 4; Insulation Resistance: 5GR; Gender: Male; Connector Type: Male Pin; Contact Post Length: 3.05mm; Supplier 1: Avnet; Manufacturer Part Number: 68001-204HLF; RoHS: Yes; Category: Headers and Wire Housings; Stock 1: 49133; Pricing 1: 2000=0,16952, 4000=0,16482, 8000=0,16036, 12000=0,15614, 20000=0,15214 (USD); Mount: Through Hole; Color: Black; Contact Plating: Gold,GXT; Contact Material: Bronze; Housing Material: Thermoplastic; Min Operating Temperature: -65°C; Max Operating Temperature: 125°C; Package Quantity: 100; Number of Rows: 1; Packaging: Bulk; Contact Gender: Male; Termination: Solder; Number of Contacts: 4; Orientation: Straight; Pitch: 2.54mm; Contact Mating Length: 0.23inch; Radiation Hardening: No; Flammability Rating: UL94 V-0; ComponentLink1URL: https://datasheet.ciiva.com/5164/68000-274255-5164127.pdf?src-supplier=Mouser; ComponentLink1Description: https://datasheet.ciiva.com/5164/68000-274255-5164127.pdf?src-supplier=Mouser; ComponentLink2URL: https://datasheet.ciiva.com/726/68000-726529.pdf?src-supplier=Digi-Key; ComponentLink2Description: https://datasheet.ciiva.com/726/68000-726529.pdf?src-supplier=Digi-Key; Supplier Part Number 1: 68001-204HLF
L1 = L1210R2R2MDWIT: FIXED IND 2.2UH 2A 80 MOHM SMD; Manufacturer: KEMET; Core Material: Ferrite; Tolerance: 20%; Shielding: Unshielded; Self Resonant Frequency: 190MHz; DC Resistance (DCR): 80mR; Test Frequency: 100kHz; DC Current: 1.13A; Supplier 1: Mouser; Manufacturer Part Number: L1210R2R2MDWIT; RoHS: Yes; Category: Fixed Inductors; Stock 1: 3521; Pricing 1: 1=0,55000, 10=0,44700, 100=0,30300, 500=0,27200, 1000=0,20200, 2000=0,17800 (USD); Mount: Surface Mount; Case/Package: 1210; Case Code (Metric): 3225; Case Code (Imperial): 1210; Min Operating Temperature: -40°C; Max Operating Temperature: 105°C; Inductance: 2.2uH; Max DC Current: 2A; Package Quantity: 1000; Current Rating: 2A; Packaging: Tape and Reel; Inductance Tolerance: 20%; Composition: Wirewound,Ceramic; Termination: SMD/SMT; Military Standard: Not; Length: 0.126inch; Height: 2.5mm; Width: 0.098inch; Height - Seated (Max): 0.106inch; Depth: 2.7mm; Radiation Hardening: No; REACH SVHC: No SVHC; ComponentLink1URL: https://datasheet.ciiva.com/4957/f3115-4957838.pdf?src-supplier=Mouser; ComponentLink1Description: https://datasheet.ciiva.com/4957/f3115-4957838.pdf?src-supplier=Mouser; ComponentLink2URL: https://datasheet.ciiva.com/6691/f3115-6691487.pdf?src-supplier=Digi-Key; ComponentLink2Description: https://datasheet.ciiva.com/6691/f3115-6691487.pdf?src-supplier=Digi-Key; ComponentLink3URL: https://datasheet.ciiva.com/8512/f3115-8512543.pdf?src-supplier=Avnet; ComponentLink3Description: https://datasheet.ciiva.com/8512/f3115-8512543.pdf?src-supplier=Avnet; ComponentLink4URL: https://datasheet.ciiva.com/17280/f3115-17280270.pdf?src-supplier=Avnet+Europe; ComponentLink4Description: https://datasheet.ciiva.com/17280/f3115-17280270.pdf?src-supplier=Avnet+Europe; ComponentLink5URL: https://datasheet.ciiva.com/22685/27262-22685038.pdf?src-supplier=Element14; ComponentLink5Description: https://datasheet.ciiva.com/22685/27262-22685038.pdf?src-supplier=Element14; Supplier Part Number 1: 80-L1210R2R2MDWIT
LINK1-LINK3 = QPC02SXGN-RC: CONN JUMPER SHORTING .100" GOLD; Manufacturer: Sullins; Number of Positions: 2; Pitch: 0.1inch; Supplier 1: Future Electronics; Manufacturer Part Number: QPC02SXGN-RC; RoHS: Yes; Category: Connectors; Stock 1: 5279; Pricing 1: 1=0,02960, 1500=0,02530, 5000=0,02470, 15000=0,02410, 50000=0,02350 (USD); Case/Package: 100; Contact Plating: Gold; Package Quantity: 2000; Packaging: Bulk; Height: 0.235inch; Lead Free: Lead Free; ComponentLink1URL: https://datasheet.ciiva.com/767/284-sxgn-11510-767869.pdf?src-supplier=Digi-Key; ComponentLink1Description: https://datasheet.ciiva.com/767/284-sxgn-11510-767869.pdf?src-supplier=Digi-Key; Supplier Part Number 1: QPC02SXGN-RC-BAG
MH1-MH3 = MH_7.4MMC_3.2MMD: Mounting Hole  7.4mm, 3.2mm
MH4 = MH_7.4MMNC_3.2MMD: Mounting Hole 7.4mm Diameter(no copper hole) 3.2mm Drill NPTH
R1 = RC0805FR-07100KL: RES SMD 100K OHM 1% 1/8W 0805; Manufacturer: Yageo; Resistance: 100kR; Temperature Coefficient: 100ppm/°C; Power Rating: 125mW; Voltage Rating (DC): 150V; Supplier 1: Future Electronics; Manufacturer Part Number: RC0805FR-07100KL; RoHS: Yes; Category: Chip SMD Resistors; Stock 1: 9815333; Pricing 1: 1=0,00630, 100=0,00480, 250=0,00450, 500=0,00440, 1500=0,00410 (USD); Case/Package: 0805; Number of Pins: 2; Case Code (Metric): 2012; Case Code (Imperial): 0805; Min Operating Temperature: -55°C; Max Operating Temperature: 155°C; Composition: Thick Film; Tolerance: 1%; Packaging: Tape and Reel; Voltage Rating: 150V; Package Quantity: 1; Number of Terminations: 2; Termination: SMD/SMT; Military Standard: Not; Max Power Dissipation: 125mW; Features: Moisture Resistant; Length: 2mm; Height: 0.024inch; Width: 0.049inch; Depth: 1.25mm; Lead Pitch: 0.4mm; REACH SVHC: Unknown; Lead Free: Lead Free; ComponentLink1URL: https://datasheet.ciiva.com/11808/0900766b8106beab-11808858.pdf?src-supplier=RSComponents; ComponentLink1Description: https://datasheet.ciiva.com/11808/0900766b8106beab-11808858.pdf?src-supplier=RSComponents; ComponentLink2URL: https://datasheet.ciiva.com/2457/pyu-r-int-thick-7-2457017.pdf?src-supplier=Digi-Key; ComponentLink2Description: https://datasheet.ciiva.com/2457/pyu-r-int-thick-7-2457017.pdf?src-supplier=Digi-Key; ComponentLink3URL: https://datasheet.ciiva.com/12667/rc0805-12667001.pdf?src-supplier=Mouser; ComponentLink3Description: https://datasheet.ciiva.com/12667/rc0805-12667001.pdf?src-supplier=Mouser; ComponentLink4URL: https://datasheet.ciiva.com/2457/pyu-r-int-thick-7-2457018.pdf?src-supplier=Digi-Key; ComponentLink4Description: https://datasheet.ciiva.com/2457/pyu-r-int-thick-7-2457018.pdf?src-supplier=Digi-Key; ComponentLink5URL: https://datasheet.ciiva.com/16747/rc0805-16747226.pdf?src-supplier=Future+Electronics; ComponentLink5Description: https://datasheet.ciiva.com/16747/rc0805-16747226.pdf?src-supplier=Future+Electronics; ComponentLink6URL: https://datasheet.ciiva.com/2457/pyu-r-int-thick-7-2457019.pdf?src-supplier=Digi-Key; ComponentLink6Description: https://datasheet.ciiva.com/2457/pyu-r-int-thick-7-2457019.pdf?src-supplier=Digi-Key; ComponentLink7URL: https://datasheet.ciiva.com/7660/38627-7660796.pdf?src-supplier=Element14; ComponentLink7Description: https://datasheet.ciiva.com/7660/38627-7660796.pdf?src-supplier=Element14; ComponentLink8URL: https://datasheet.ciiva.com/7941/1697719-7941676.pdf?src-supplier=Element14; ComponentLink8Description: https://datasheet.ciiva.com/7941/1697719-7941676.pdf?src-supplier=Element14; ComponentLink9URL: https://datasheet.ciiva.com/7941/1686128-7941677.pdf?src-supplier=Element14; ComponentLink9Description: https://datasheet.ciiva.com/7941/1686128-7941677.pdf?src-supplier=Element14; ComponentLink10URL: https://datasheet.ciiva.com/7941/1697719-7941678.pdf?src-supplier=Element14; ComponentLink10Description: https://datasheet.ciiva.com/7941/1697719-7941678.pdf?src-supplier=Element14; ComponentLink11URL: https://datasheet.ciiva.com/22747/444164-22747534.pdf?src-supplier=Element14; ComponentLink11Description: https://datasheet.ciiva.com/22747/444164-22747534.pdf?src-supplier=Element14; Supplier Part Number 1: RC0805FR-07100KL-CUTT
R2 R3 R15 R17 R22 = RC0805FR-07560RL: RES SMD 560 OHM 1% 1/8W 0805; Manufacturer: Yageo; Resistance: 560R; Temperature Coefficient: 100ppm/°C; Power Rating: 125mW; Voltage Rating: 150V; Supplier 1: Future Electronics; Manufacturer Part Number: RC0805FR-07560RL; RoHS: Yes; Category: Chip SMD Resistors; Stock 1: 161950; Pricing 1: 1=0,09800, 250=0,01440, 750=0,00980, 1500=0,00770, 2500=0,00640 (USD); Case/Package: 0805; Weight: 0.000194oz; Case Code (Metric): 2012; Case Code (Imperial): 0805; Min Operating Temperature: -55°C; Max Operating Temperature: 155°C; Tolerance: 1%; Composition: Thick Film; Packaging: Tape and Reel; Package Quantity: 1; Number of Terminations: 2; Termination: SMD/SMT; Military Standard: Not; Max Power Dissipation: 125mW; Features: Moisture Resistant; Length: 2mm; Height: 0.5mm; Width: 0.049inch; Depth: 1.25mm; REACH SVHC: Unknown; Lead Free: Lead Free; ComponentLink1URL: https://datasheet.ciiva.com/5561/rc0805-5561861.pdf?src-supplier=Mouser; ComponentLink1Description: https://datasheet.ciiva.com/5561/rc0805-5561861.pdf?src-supplier=Mouser; ComponentLink2URL: https://datasheet.ciiva.com/2457/pyu-r-int-thick-7-2457142.pdf?src-supplier=Digi-Key; ComponentLink2Description: https://datasheet.ciiva.com/2457/pyu-r-int-thick-7-2457142.pdf?src-supplier=Digi-Key; ComponentLink3URL: https://datasheet.ciiva.com/2457/pyu-r-int-thick-7-2457140.pdf?src-supplier=Digi-Key; ComponentLink3Description: https://datasheet.ciiva.com/2457/pyu-r-int-thick-7-2457140.pdf?src-supplier=Digi-Key; ComponentLink4URL: https://datasheet.ciiva.com/2457/pyu-r-int-thick-7-2457141.pdf?src-supplier=Digi-Key; ComponentLink4Description: https://datasheet.ciiva.com/2457/pyu-r-int-thick-7-2457141.pdf?src-supplier=Digi-Key; ComponentLink5URL: https://datasheet.ciiva.com/7941/444164-7941813.pdf?src-supplier=Element14; ComponentLink5Description: https://datasheet.ciiva.com/7941/444164-7941813.pdf?src-supplier=Element14; ComponentLink6URL: https://datasheet.ciiva.com/7941/444164-7941814.pdf?src-supplier=Element14; ComponentLink6Description: https://datasheet.ciiva.com/7941/444164-7941814.pdf?src-supplier=Element14; Supplier Part Number 1: RC0805FR-07560RL-CUTT